# Altium schematic sheet Nixies-3-4.SchDoc: =ProjectTitle
size 297 x 209 mm; Address1: Address1; Address2: Address2; Address3: Address3; Address4: Address4; SheetNumber: ?; SheetTotal: ?; Scale: 1:1; DocumentType: Схема электрическая принципиальная; Title2str: ?
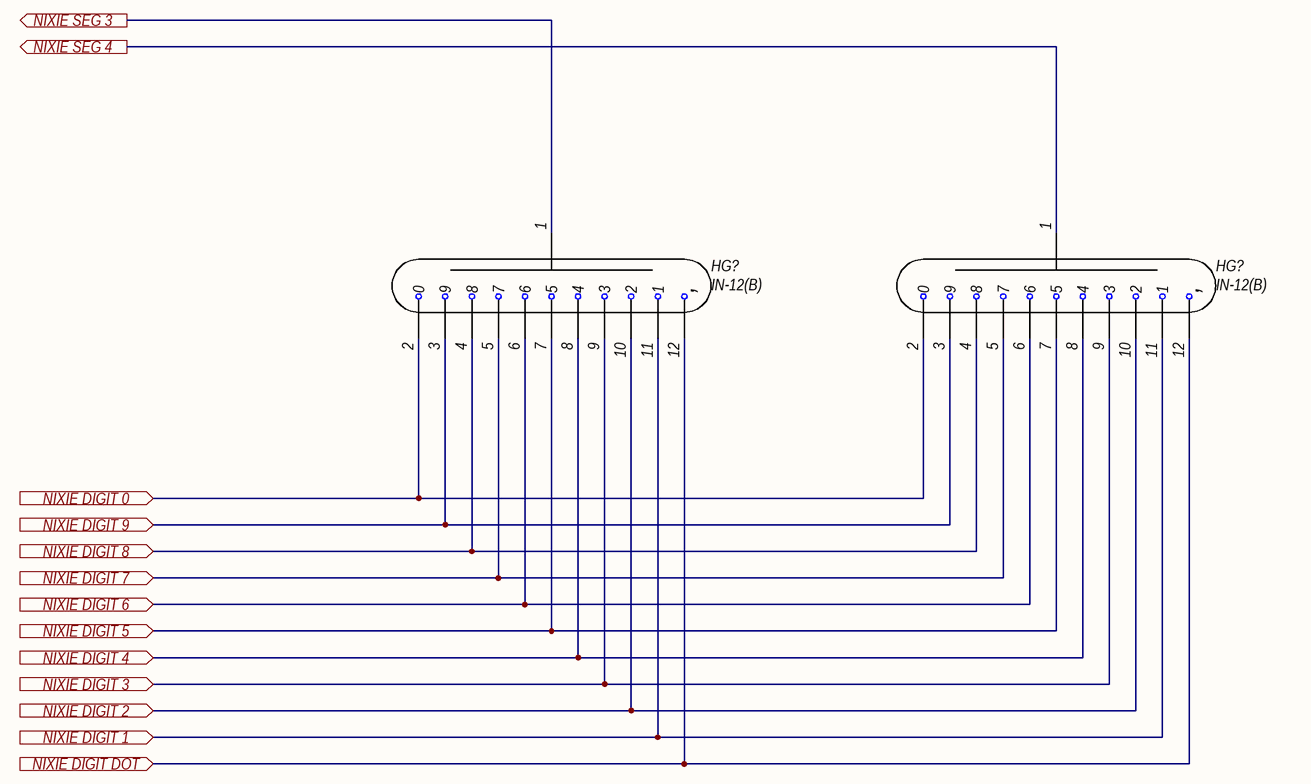
[diagram p0: Nixies-3-4.SchDoc]

## Parts
(Parts that share a designator on the sheet are numbered #1, #2 ... from top to bottom, then left to right.)
HG?#1  IN-12(B)  [IND: IN-12B]
HG?#2  IN-12(B)  [IND: IN-12B]

## Ports
NIXIE DIGIT 0 (in), NIXIE DIGIT 1 (in), NIXIE DIGIT 2 (in), NIXIE DIGIT 3 (in), NIXIE DIGIT 4 (in), NIXIE DIGIT 5 (in), NIXIE DIGIT 6 (in), NIXIE DIGIT 7 (in), NIXIE DIGIT 8 (in), NIXIE DIGIT 9 (in), NIXIE DIGIT DOT (in), NIXIE SEG 3 (out), NIXIE SEG 4 (out)

## Nets
NIXIE DIGIT 0: HG?#1.2(0) HG?#2.2(0) ; port NIXIE DIGIT 0
NIXIE DIGIT 1: HG?#1.11(1) HG?#2.11(1) ; port NIXIE DIGIT 1
NIXIE DIGIT 2: HG?#1.10(2) HG?#2.10(2) ; port NIXIE DIGIT 2
NIXIE DIGIT 3: HG?#1.9(3) HG?#2.9(3) ; port NIXIE DIGIT 3
NIXIE DIGIT 4: HG?#1.8(4) HG?#2.8(4) ; port NIXIE DIGIT 4
NIXIE DIGIT 5: HG?#1.7(5) HG?#2.7(5) ; port NIXIE DIGIT 5
NIXIE DIGIT 6: HG?#1.6 HG?#2.6 ; port NIXIE DIGIT 6
NIXIE DIGIT 7: HG?#1.5(7) HG?#2.5(7) ; port NIXIE DIGIT 7
NIXIE DIGIT 8: HG?#1.4(8) HG?#2.4(8) ; port NIXIE DIGIT 8
NIXIE DIGIT 9: HG?#1.3(9) HG?#2.3(9) ; port NIXIE DIGIT 9
NIXIE DIGIT DOT: HG?#1.12(,) HG?#2.12(,) ; port NIXIE DIGIT DOT
NIXIE SEG 3: HG?#1.1 ; port NIXIE SEG 3
NIXIE SEG 4: HG?#2.1 ; port NIXIE SEG 4

## Notes on the sheet
- Изм.
- Лист
- № докум.
- Подп.
- Дата
- Копировал
- Формат А4

## Library data of the parts
HG?#1 HG?#2 = IN-12(B): Nixie tube, digits + dot; Manufacturer: USSR; Model: IN-12(B); ComponentKind: Nixie tube; HelpURL: https://rudatasheet.ru/tubes/in-12/